# EAGLE design balancedphotodiode (EAGLE 7.4.0)
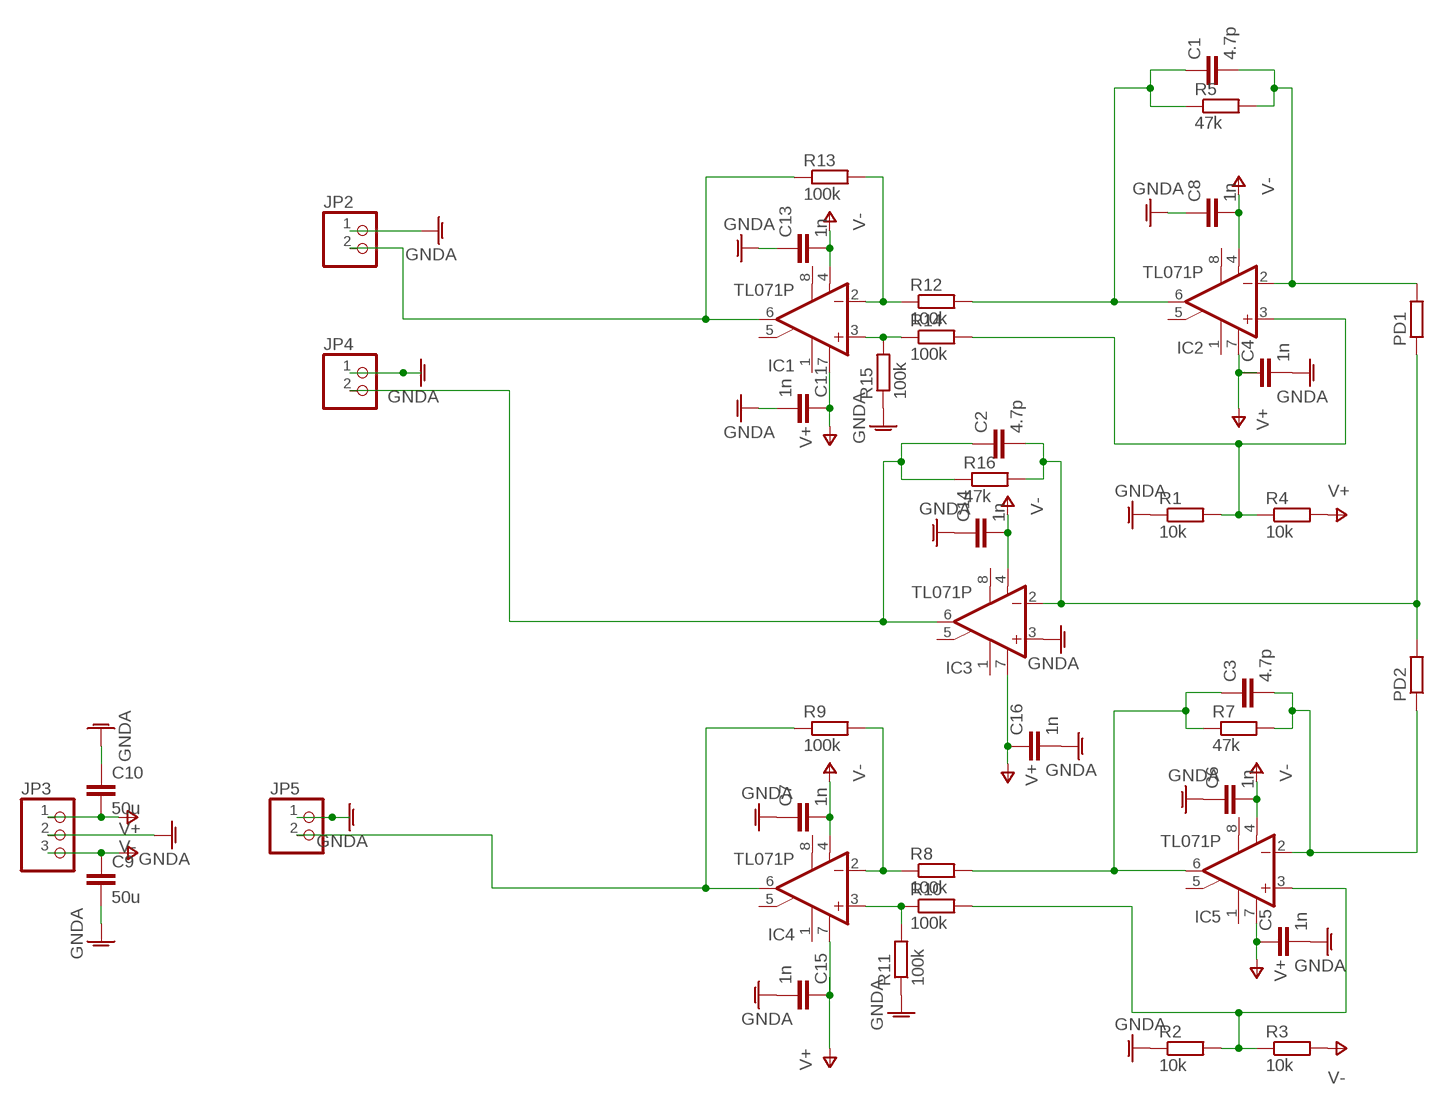
[diagram p0: schematic, sheet 1]

## Parts
C1  4.7p  C-EU025-024X044  [C025-024X044]
C2  4.7p  C-EU025-024X044  [C025-024X044]
C3  4.7p  C-EU025-024X044  [C025-024X044]
C4  1n  C-EUC1206  [C1206]
C5  1n  C-EUC1206  [C1206]
C6  1n  C-EUC1206  [C1206]
C7  1n  C-EUC1206  [C1206]
C8  1n  C-EUC1206  [C1206]
C9  50u  C-EU025-050X050  [C025-050X050]
C10  50u  C-EU025-050X050  [C025-050X050]
C11  1n  C-EUC1206  [C1206]
C13  1n  C-EUC1206  [C1206]
C14  1n  C-EUC1206  [C1206]
C15  1n  C-EUC1206  [C1206]
C16  1n  C-EUC1206  [C1206]
IC1  TL071P  [DIL08]
IC2  TL071P  [DIL08]
IC3  TL071P  [DIL08]
IC4  TL071P  [DIL08]
IC5  TL071P  [DIL08]
JP2  PINHD-1X2/90  [1X02/90]
JP3  PINHD-1X3/90  [1X03/90]
JP4  PINHD-1X2/90  [1X02/90]
JP5  PINHD-1X2/90  [1X02/90]
PD1  R-EU_0204/2V  [0204V]
PD2  R-EU_0204/2V  [0204V]
R1  10k  R-EU_0207/7  [0207/7]
R2  10k  R-EU_0207/7  [0207/7]
R3  10k  R-EU_0207/7  [0207/7]
R4  10k  R-EU_0207/7  [0207/7]
R5  47k  R-EU_0207/7  [0207/7]
R7  47k  R-EU_0207/7  [0207/7]
R8  100k  R-EU_0207/7  [0207/7]
R9  100k  R-EU_0207/7  [0207/7]
R10  100k  R-EU_0207/7  [0207/7]
R11  100k  R-EU_0207/7  [0207/7]
R12  100k  R-EU_0207/7  [0207/7]
R13  100k  R-EU_0207/7  [0207/7]
R14  100k  R-EU_0207/7  [0207/7]
R15  100k  R-EU_0207/7  [0207/7]
R16  47k  R-EU_0207/7  [0207/7]

## Nets
GNDA: C4.2 C5.2 C6.1 C7.1 C8.1 C9.2 C10.1 C11.2 C13.1 C14.1 C15.2 C16.2 IC3.3(+IN) JP2.1 JP3.2 JP4.1 JP5.1 R1.1 R2.1 R11.1 R15.1
N$1: C1.2 IC2.2(-IN) PD1.2 R5.2
N$2: C1.1 IC2.6(OUT) R5.1 R12.2
N$3: C2.2 IC3.2(-IN) PD1.1 PD2.2 R16.2
N$4: C3.2 IC5.2(-IN) PD2.1 R7.2
N$5: C3.1 IC5.6(OUT) R7.1 R8.2
N$6: C2.1 IC3.6(OUT) JP4.2 R16.1
N$7: IC1.2(-IN) R12.1 R13.2
N$8: IC4.2(-IN) R8.1 R9.2
N$9 [top]: IC1.6(OUT) JP2.2 R13.1
N$10: IC4.6(OUT) JP5.2 R9.1
N$11: IC5.3(+IN) R2.2 R3.1 R10.2
N$12: IC4.3(+IN) R10.1 R11.2
N$13 [top]: IC1.3(+IN) R14.1 R15.2
N$14: IC2.3(+IN) R1.2 R4.1 R14.2
V+: C4.1 C5.1 C9.1 C11.1 C15.1 C16.1 IC1.7(V+) IC2.7(V+) IC3.7(V+) IC4.7(V+) IC5.7(V+) JP3.3 R4.2
V-: C6.2 C7.2 C8.2 C10.2 C13.2 C14.2 IC1.4(V-) IC2.4(V-) IC3.4(V-) IC4.4(V-) IC5.4(V-) JP3.1 R3.2
Unconnected: IC1.1(ON1) IC1.5(ON2) IC1.8(OPT) IC2.1(ON1) IC2.5(ON2) IC2.8(OPT) IC3.1(ON1) IC3.5(ON2) IC3.8(OPT) IC4.1(ON1) IC4.5(ON2) IC4.8(OPT) IC5.1(ON1) IC5.5(ON2) IC5.8(OPT)

## Library data of the parts
C1-C11 C13-C16 = rcl:C-EU: CAPACITOR, European symbol
IC1-IC5 = linear:TL071: OP AMP
JP2 JP4 JP5 = pinhead:PINHD-1X2: PIN HEADER
JP3 = pinhead:PINHD-1X3: PIN HEADER
PD1 PD2 R1-R5 R7-R16 = rcl:R-EU_: RESISTOR, European symbol

## Net classes
1 top: width 0.609 mm
2 bottom: width 0.61 mm

## Board
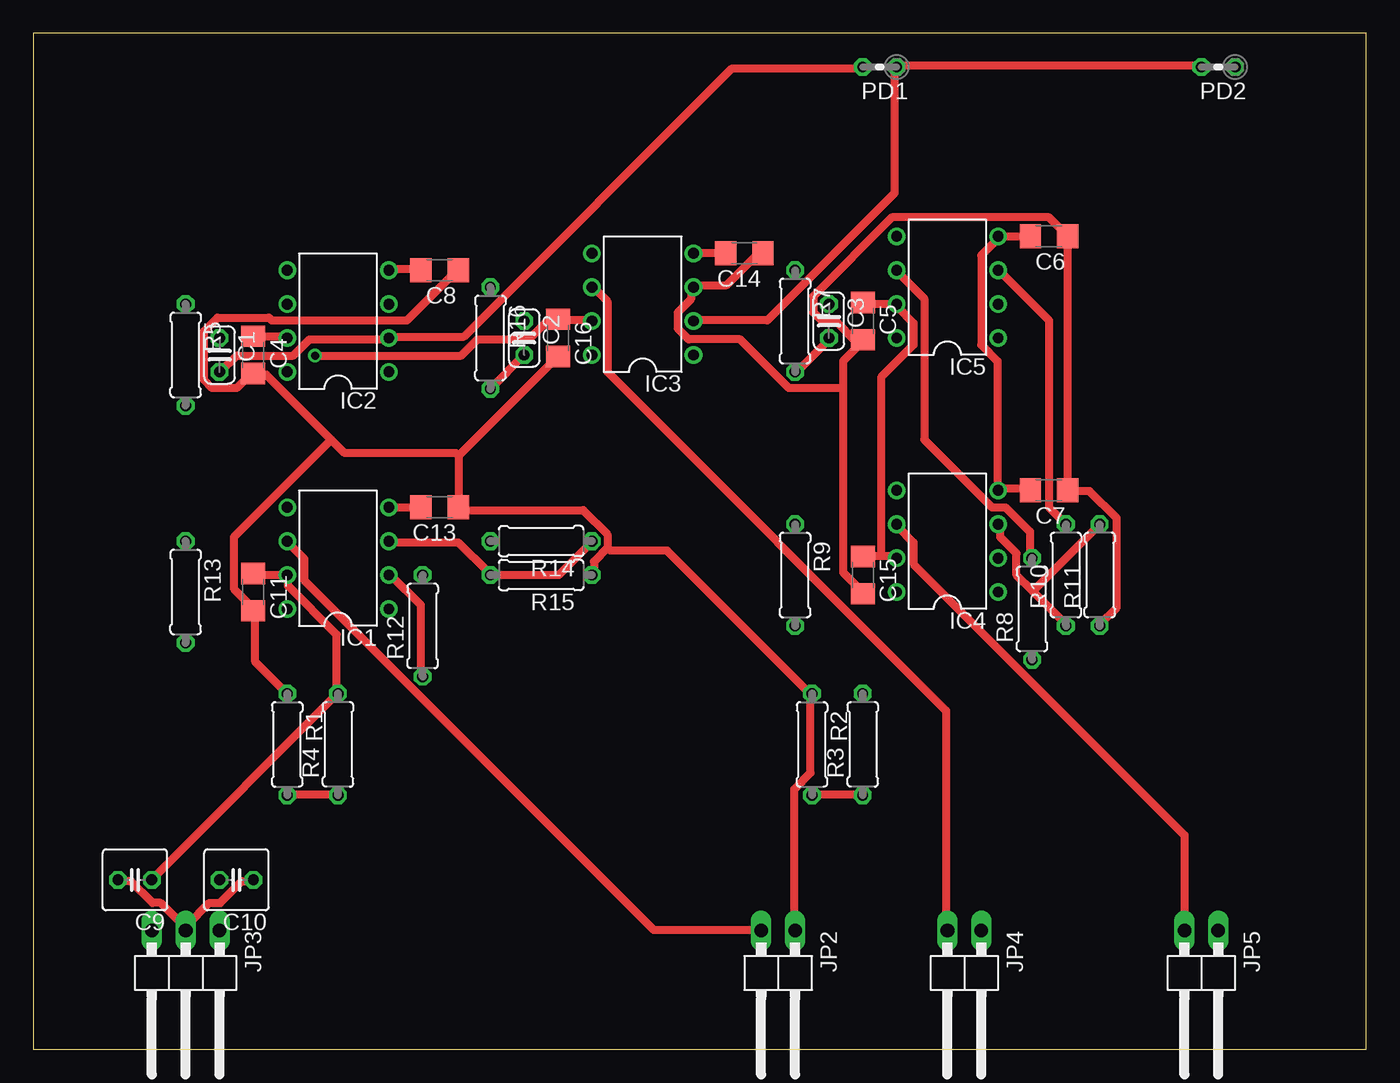
[diagram p1: board, top side]
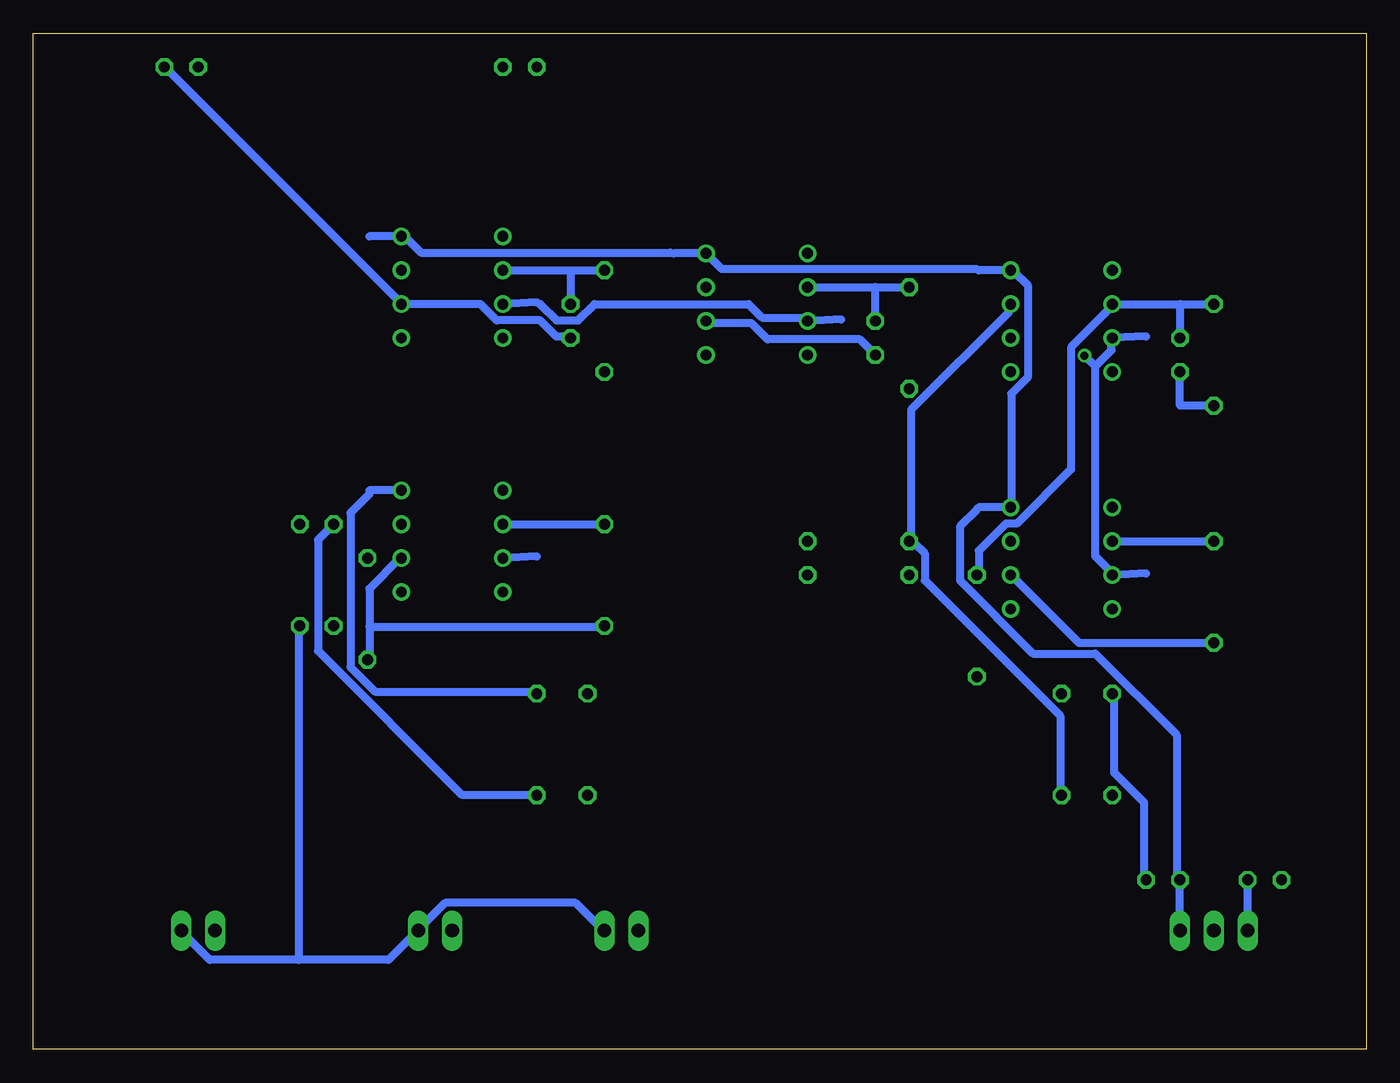
[diagram p2: board, bottom side, seen from below]

Size 100 x 76.19 mm. Coordinates in mm from the lower left corner, seen from the top.
Outline: 0,0 100,0 100,76.19 0,76.19 0,0
Copper layers (1*16): Top 0.035mm / dielectric 1.5mm / Bottom 0.035mm
Design rules "default *": minimum track width 24mil, minimum drill 24mil, track to track 8mil, track to pad 8mil, pad to pad 8mil, via to via 8mil, smd to smd 8mil, copper to edge 40mil, drill to drill 8mil, minimum pad ring 10mil, minimum via ring 8mil, stop-mask expansion 4mil, vias tented up to drill 0mil, thermal gap 10mil

### Footprints (pad centres in the part's own frame; a part is rotated, then mirrored left to right if it is on the bottom)
C025-024X044 = drill 0.813 octagon: 1 -1.27,0; 2 1.27,0
C1206 = smd 1.6 x 1.8: 1 -1.4,0; 2 1.4,0
C025-050X050 = drill 0.813 octagon: 1 -1.27,0; 2 1.27,0
DIL08 = drill 0.813 pad 1.27: 1 -3.81,-3.81; 2 -1.27,-3.81; 3 1.27,-3.81; 4 3.81,-3.81; 5 3.81,3.81; 6 1.27,3.81; 7 -1.27,3.81; 8 -3.81,3.81
1X02/90 = drill 1.016 long: 1 -1.27,-3.81; 2 1.27,-3.81
1X03/90 = drill 1.016 long: 1 -2.54,-3.81; 2 0,-3.81; 3 2.54,-3.81
0204V = drill 0.813 octagon: 1 -1.27,0; 2 1.27,0
0207/7 = drill 0.813 octagon: 1 -3.81,0; 2 3.81,0

### Placement (x,y rotation side)
C1  13.97,52.07 270 top
C2  36.83,53.34 270 top
C3  59.69,54.61 270 top
C4  16.51,52.07 270 top
C5  62.23,54.61 270 top
C6  76.2,60.96 180 top
C7  76.2,41.91 180 top
C8  30.48,58.42 180 top
C9  7.62,12.7 180 top
C10  15.24,12.7 180 top
C11  16.51,34.29 270 top
C13  30.48,40.64 180 top
C14  53.34,59.69 180 top
C15  62.23,35.56 270 top
C16  39.37,53.34 270 top
IC1  22.86,36.83 90 top
IC2  22.86,54.61 90 top
IC3  45.72,55.88 90 top
IC4  68.58,38.1 90 top
IC5  68.58,57.15 90 top
JP2  55.88,5.08 180 top
JP3  11.43,5.08 180 top
JP4  69.85,5.08 180 top
JP5  87.63,5.08 180 top
PD1  63.5,73.66 180 top
PD2  88.9,73.66 180 top
R1  19.05,22.86 270 top
R2  58.42,22.86 270 top
R3  62.23,22.86 90 top
R4  22.86,22.86 90 top
R5  11.43,52.07 270 top
R7  57.15,54.61 270 top
R8  74.93,33.02 90 top
R9  57.15,35.56 270 top
R10  77.47,35.56 90 top
R11  80.01,35.56 90 top
R12  29.21,31.75 90 top
R13  11.43,34.29 270 top
R14  38.1,38.1 180 top
R15  38.1,35.56 180 top
R16  34.29,53.34 270 top

### Tracks (layer width: path | path; a pad name or v marks a point on that pad's centre or on a via)
GNDA
  Top 0.61: R1.1 16.66,29.06 16.66,32.72 C11.2 16.46,33.12 15.04,34.54 15.04,38.41 22.35,45.72 | C9.2 6.5,12.6 7.32,12.6 8.94,10.97 9.55,10.97 11.58,8.94 JP3.2 11.58,9.35 13.21,10.97 14.02,10.97 15.65,12.6 16.46,12.6 C10.1 | 31.9,44.5 31.9,40.64 C13.1 32.11,40.44 41.25,40.44 43.08,38.61 43.08,37.59 | 31.9,44.5 39.22,51.82 C16.2 | 22.35,45.72 23.37,44.7 31.7,44.7 31.9,44.5 | 22.35,45.72 17.48,50.6 16.66,50.6 C4.2 16.26,50.6 15.24,49.58 13.41,49.58 12.8,50.19 12.8,53.85 13.82,54.86 17.68,54.86 17.88,54.66 28.04,54.66 31.7,58.32 C8.1 | 43.08,37.59 42.06,36.58 42.06,35.56 R15.1 | C14.1 54.66,59.54 54.25,59.54 52.02,57.3 49.58,57.3 IC3.3 49.38,56.9 49.38,56.29 48.36,55.27 48.36,54.05 49.17,53.24 53.03,53.24 56.69,49.58 60.76,49.58 | 60.76,49.58 60.76,51.61 62.18,53.03 C5.2 61.77,53.03 60.15,54.66 59.13,54.66 58.52,55.27 58.52,56.49 64.41,62.38 76.2,62.38 77.42,61.16 C6.1 77.62,60.96 77.62,42.06 C7.1 77.62,41.86 79.25,41.86 81.28,39.83 81.28,33.12 80.06,31.9 R11.1 | 60.76,49.58 60.76,35.76 62.18,34.34 C15.2 | JP2.1 57.1,8.94 57.1,19.51 58.32,20.73 58.32,26.62 R2.1 58.12,26.82 47.55,37.39 43.28,37.39 43.08,37.59
  Bottom 0.61: R1.1 18.9,26.62 18.9,20.73 16.66,18.49 16.66,12.8 C10.1 | JP2.1 57.3,8.94 59.33,10.97 69.09,10.97 71.12,8.94 JP4.1 71.32,8.74 73.36,6.71 80.06,6.71 | 80.06,6.71 86.77,6.71 88.8,8.74 JP5.1 | 80.06,6.71 80.06,31.7 R11.1
N$1
  Top 0.61: C1.2 14.02,50.8 15.24,52.02 19.51,52.02 20.73,53.24 26.62,53.24 IC2.2 26.82,53.44 32.31,53.44 52.43,73.56 62.18,73.56 PD1.2
  Bottom 0.61: R5.2 13.97,48.26 C1.2
N$2
  Bottom 0.61: 13.97,55.88 IC2.6 19.1,55.68 22.15,52.63 22.15,43.48 26.21,39.42 27.03,39.42 29.06,37.39 29.06,35.56 R12.2 | 13.97,55.88 R5.1 | 13.97,55.88 C1.1
N$3
  Top 0.61: C2.2 R16.2 | PD2.2 87.58,73.76 64.82,73.76 PD1.1 64.62,73.56 64.62,64.21 55.07,54.66 49.58,54.66 IC3.2
  Bottom 0.61: C2.2 38,53.24 44.91,53.24 46.13,54.46 49.38,54.46 IC3.2
N$4
  Top 0.61: R7.2 57.3,50.8 59.74,53.24 C3.2
  Bottom 0.61: C3.2 59.74,53.44 60.76,53.44 61.98,54.66 65.23,54.66 66.45,55.88 IC5.2 72.54,56.08 90.02,73.56 PD2.1
N$5
  Top 0.61: R8.2 74.78,36.98 74.78,38.81 72.95,40.64 71.93,40.64 66.85,45.72 66.85,56.29 64.82,58.32 IC5.6
  Bottom 0.61: IC5.6 59.69,58.42 | 59.69,58.42 R7.1 | 59.69,58.42 C3.1
N$6
  Top 0.61: JP4.2 68.48,8.94 68.48,25.4 43.08,50.8 43.08,56.08 42.06,57.1 IC3.6
  Bottom 0.61: IC3.6 36.83,57.15 | 36.83,57.15 R16.1 | C2.1 36.83,57.15
N$7
  Top 0.61: R12.1 29.06,28.04 29.06,33.33 26.82,35.56 IC1.2
  Bottom 0.61: R13.2 21.54,30.48 26.62,35.56 IC1.2
N$8
  Bottom 0.61: 74.78,31.7 74.78,34.54 72.54,36.78 IC4.2 | 74.78,31.7 74.78,29.26 R8.1 | 74.78,31.7 57.3,31.7 R9.2
N$9
  Top 0.61: JP2.2 54.46,8.94 46.53,8.94 20.32,35.15 20.32,36.78 19.1,38 IC1.6
  Bottom 0.61: IC1.6 R13.1
N$10
  Top 0.61: JP5.2 86.36,16.05 66.04,36.37 66.04,38 64.82,39.22 IC4.6
  Bottom 0.61: IC4.6 R9.1
N$11
  Top 0.61: R2.2 58.52,19.1 62.18,19.1 R3.1 | R10.2 76.2,40.64 76.2,54.66 72.54,58.32 IC5.3
  Bottom 0.61: R10.2 78.64,38.2 78.64,29.87 67.87,19.1 62.38,19.1 R3.1
N$12
  Top 0.61: 74.98,34.34 77.42,31.9 R10.1 | 74.98,34.34 73.76,35.56 73.76,37.19 72.54,38.41 72.54,39.22 IC4.3 | 74.98,34.34 R11.2
N$13
  Top 0.61: R14.1 41.86,38 39.42,35.56 R15.2 34.14,35.76 31.9,38 26.82,38 IC1.3
N$14
  Top 0.61: R1.2 19.1,19.1 22.76,19.1 R4.1
  Bottom 0.61: IC2.3 26.82,55.88 26.82,55.27 34.14,47.95 34.14,38.2 R14.2 33.93,38 33.12,37.19 33.12,35.15 22.96,24.99 22.96,19.1 R4.1
V+  (via drill 0.61)
  Top 0.61: 63.6,36.98 64.62,36.98 IC4.7 | 63.6,36.98 62.38,36.98 C15.1 | IC3.7 41.86,54.66 39.42,54.66 C16.1 39.22,54.46 38.41,54.46 37.19,53.24 33.33,53.24 32.11,52.02 v21.13,52.02 | C5.1 62.38,55.88 IC5.7 64.82,55.68 66.04,54.46 66.04,52.83 63.6,50.39 63.6,36.98 | C4.1 16.66,53.44 18.9,53.44 IC2.7 | C11.1 16.66,35.56 IC1.7 19.1,35.36 19.1,34.75 22.76,31.09 22.76,26.82 R4.2 22.76,26.62 8.94,12.8 C9.1
  Bottom 0.61: C4.1 IC2.7 19.1,53.03 19.1,52.43 20.32,51.21 | C11.1 IC1.7 19.1,35.76 20.32,36.98 20.32,51.21 | C16.1 IC3.7 42.06,54.86 45.31,54.86 46.33,55.88 57.91,55.88 59.13,54.66 60.76,54.66 61.98,55.88 C5.1 IC5.7 | C15.1 IC4.7 | JP3.3 C9.1 | 20.32,51.21 v21.13,52.02
V-
  Top 0.61: IC1.4 C13.2 | C8.2 29.06,58.52 26.82,58.52 IC2.4 | C7.2 74.78,42.06 72.54,42.06 IC4.4 72.34,42.27 72.34,51.61 71.12,52.83 71.12,59.54 72.34,60.76 IC5.4 C6.2 | C14.2 51.82,59.74 49.58,59.74 IC3.4
  Bottom 0.61: IC4.4 74.78,41.91 | 74.78,41.91 C7.2 | C6.2 IC5.4 72.14,60.96 70.92,59.74 52.22,59.74 C14.2 IC3.4 48.36,58.52 29.26,58.52 C8.2 IC2.4 26.42,58.32 25.4,57.3 25.4,50.39 26.62,49.17 26.62,40.84 IC1.4 C13.2 29.26,40.44 30.48,39.22 30.48,35.15 24.99,29.67 20.32,29.67 14.22,23.57 14.22,12.8 C10.2 JP3.1 | R3.2 62.38,26.82 74.37,26.82 76.2,28.65 76.2,40.23 74.78,41.66 74.78,41.91